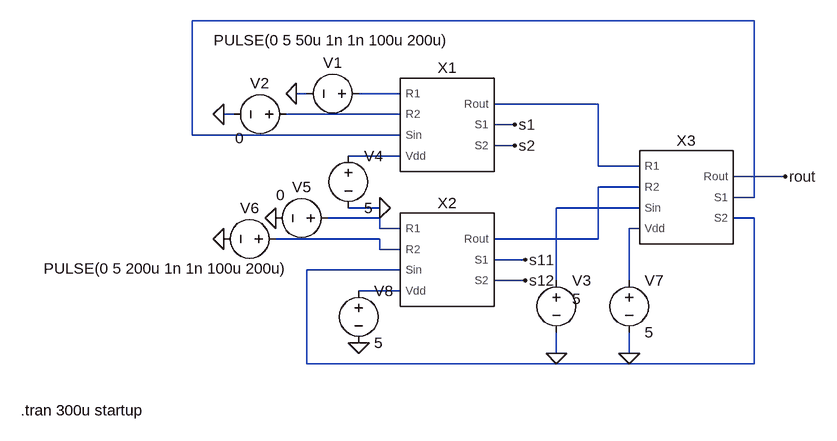
[diagram p0: schematic arbiter_tree.asc]
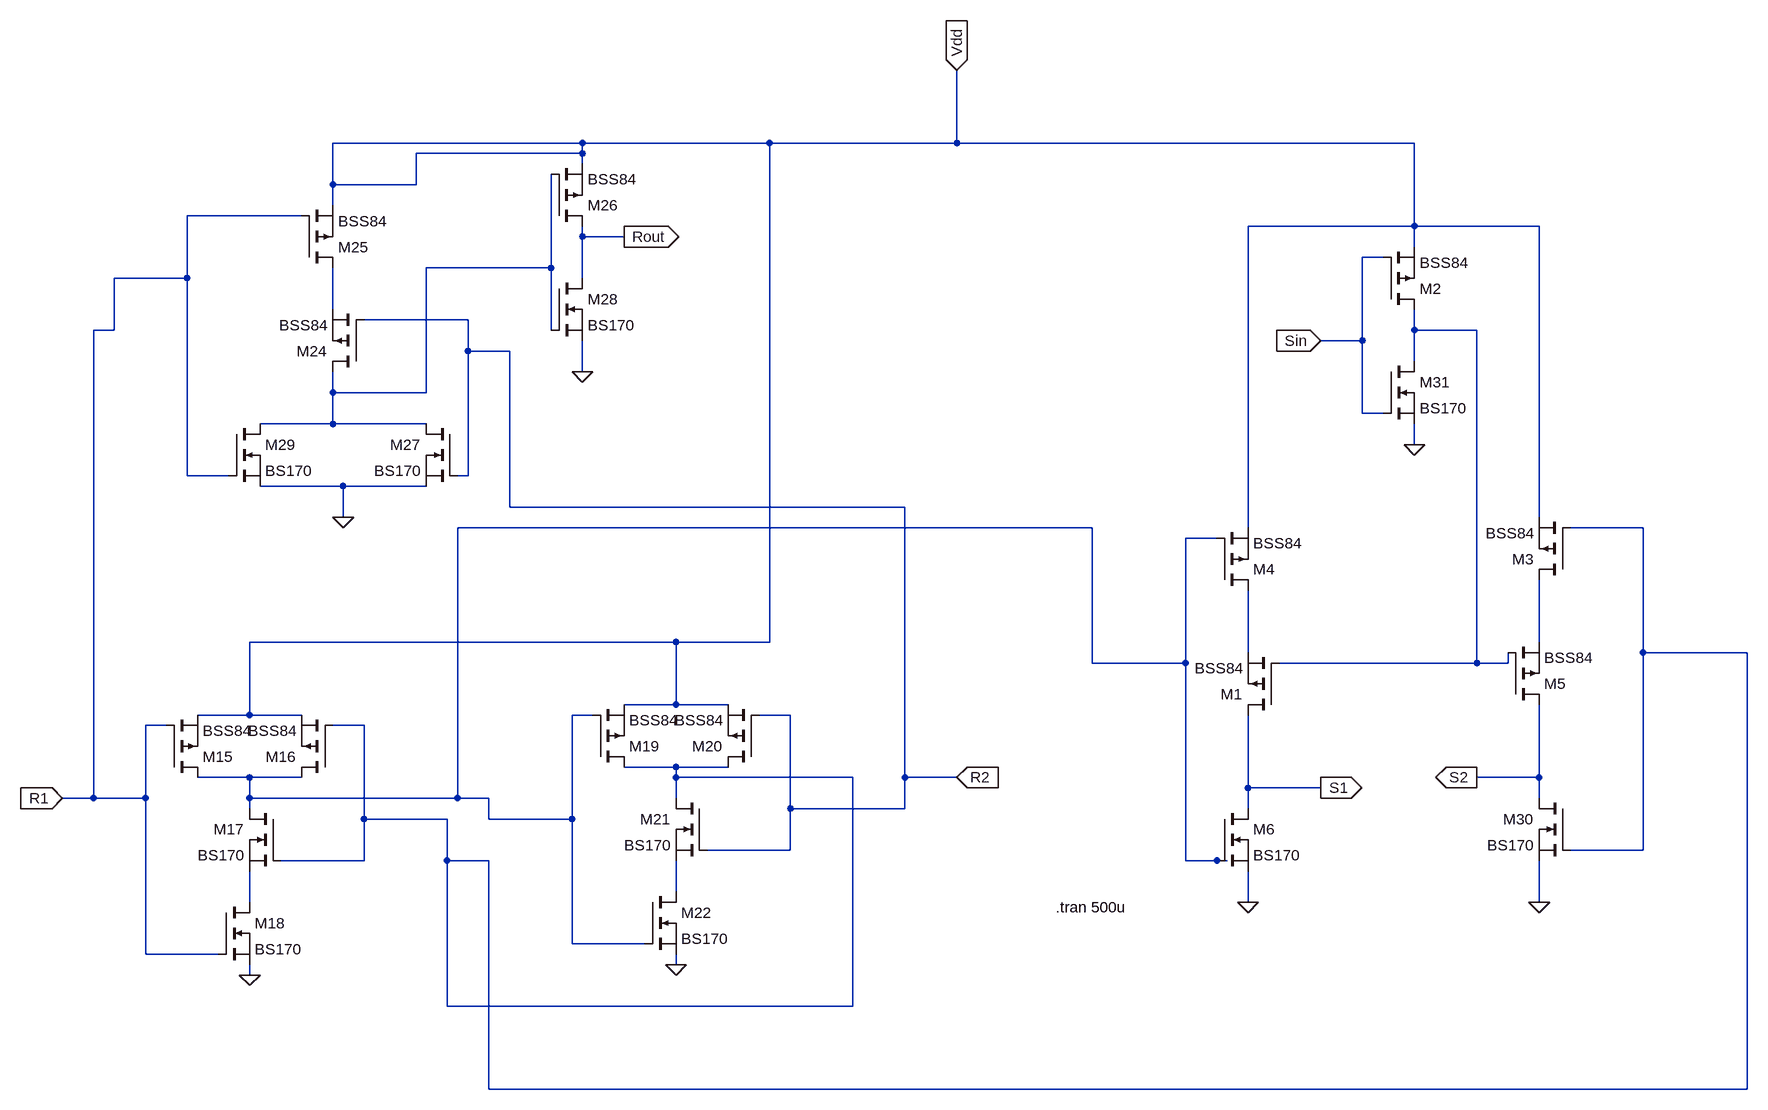
[diagram p1: sub-circuit arbiter.asc]
arbiter_tree.asc, the LTspice schematic file:
Version 4.1
SHEET 1 1124 680
WIRE 640 -80 -224 -80
WIRE -48 32 -64 32
WIRE 96 32 32 32
WIRE 400 48 240 48
WIRE -160 64 -176 64
WIRE 96 64 -80 64
WIRE 272 80 240 80
WIRE -224 96 -224 -80
WIRE 96 96 -224 96
WIRE 272 112 240 112
WIRE 96 128 16 128
WIRE 400 144 400 48
WIRE 464 144 400 144
WIRE 688 160 608 160
WIRE 464 176 400 176
WIRE 640 192 640 -80
WIRE 640 192 608 192
WIRE 64 208 16 208
WIRE 464 208 336 208
WIRE 64 224 -16 224
WIRE 640 224 608 224
WIRE 64 240 64 224
WIRE 96 240 64 240
WIRE 464 240 448 240
WIRE 64 256 -96 256
WIRE 400 256 400 176
WIRE 400 256 240 256
WIRE 64 272 64 256
WIRE 96 272 64 272
WIRE 288 288 240 288
WIRE 96 304 -48 304
WIRE 288 320 240 320
WIRE 336 320 336 208
WIRE 448 320 448 240
WIRE 96 336 32 336
WIRE 336 432 336 400
WIRE 448 432 448 400
WIRE -48 448 -48 304
WIRE 640 448 640 224
WIRE 640 448 -48 448
FLAG -64 32 0
FLAG -176 64 0
FLAG 64 208 0
FLAG -96 224 0
FLAG -176 256 0
FLAG 32 416 0
FLAG 336 432 0
FLAG 448 432 0
FLAG 272 80 s1
FLAG 272 112 s2
FLAG 288 288 s11
FLAG 288 320 s12
FLAG 688 160 rout
SYMBOL arbiter 160 80 R0
SYMATTR InstName X1
SYMBOL arbiter 160 288 R0
SYMATTR InstName X2
SYMBOL arbiter 528 192 R0
SYMATTR InstName X3
SYMBOL voltage 48 32 R90
WINDOW 0 -32 56 VBottom 2
WINDOW 3 -98 57 VTop 2
WINDOW 123 0 0 Left 0
WINDOW 39 0 0 Left 0
SYMATTR InstName V1
SYMATTR Value PULSE(0 5 50u 1n 1n 100u 200u)
SYMBOL voltage -64 64 R90
WINDOW 0 -32 56 VBottom 2
WINDOW 3 21 87 VTop 2
WINDOW 123 0 0 Left 0
WINDOW 39 0 0 Left 0
SYMATTR InstName V2
SYMATTR Value 0
SYMBOL voltage 16 112 R0
WINDOW 123 0 0 Left 0
WINDOW 39 0 0 Left 0
SYMATTR InstName V4
SYMATTR Value 5
SYMBOL voltage 0 224 R90
WINDOW 0 -32 56 VBottom 2
WINDOW 3 -51 88 VTop 2
WINDOW 123 0 0 Left 0
WINDOW 39 0 0 Left 0
SYMATTR InstName V5
SYMATTR Value 0
SYMBOL voltage -80 256 R90
WINDOW 0 -32 56 VBottom 2
WINDOW 3 30 184 VTop 2
WINDOW 123 0 0 Left 0
WINDOW 39 0 0 Left 0
SYMATTR InstName V6
SYMATTR Value PULSE(0 5 200u 1n 1n 100u 200u)
SYMBOL voltage 32 320 R0
WINDOW 123 0 0 Left 0
WINDOW 39 0 0 Left 0
SYMATTR InstName V8
SYMATTR Value 5
SYMBOL voltage 336 304 R0
WINDOW 3 24 44 Left 2
WINDOW 123 0 0 Left 0
WINDOW 39 0 0 Left 0
SYMATTR Value 5
SYMATTR InstName V3
SYMBOL voltage 448 304 R0
WINDOW 123 0 0 Left 0
WINDOW 39 0 0 Left 0
SYMATTR InstName V7
SYMATTR Value 5
TEXT -488 520 Left 2 !.tran 300u startup

arbiter.asc, the sub-circuit schematic file:
Version 4.1
SHEET 1 3980 2180
WIRE 464 0 80 0
WIRE 752 0 464 0
WIRE 1040 0 1040 -112
WIRE 1040 0 752 0
WIRE 1744 0 1040 0
WIRE 464 16 464 0
WIRE 464 16 208 16
WIRE 464 32 464 16
WIRE 80 64 80 0
WIRE 208 64 208 16
WIRE 208 64 80 64
WIRE 80 96 80 64
WIRE 32 112 -144 112
WIRE 1744 128 1744 0
WIRE 1744 128 1488 128
WIRE 1936 128 1744 128
WIRE 464 144 464 128
WIRE 528 144 464 144
WIRE 1744 160 1744 128
WIRE 1696 176 1664 176
WIRE 416 192 416 48
WIRE 416 192 224 192
WIRE -144 208 -144 112
WIRE -144 208 -256 208
WIRE 464 208 464 144
WIRE 80 256 80 192
WIRE 288 272 128 272
WIRE -256 288 -256 208
WIRE -256 288 -288 288
WIRE 416 288 416 192
WIRE 1744 288 1744 256
WIRE 1840 288 1744 288
WIRE 1664 304 1664 176
WIRE 1664 304 1600 304
WIRE 288 320 288 272
WIRE 352 320 288 320
WIRE 1744 336 1744 288
WIRE 464 352 464 304
WIRE 80 384 80 352
WIRE 224 384 224 192
WIRE 224 384 80 384
WIRE 1664 416 1664 304
WIRE 1696 416 1664 416
WIRE 80 432 80 384
WIRE 80 432 -32 432
WIRE 224 432 80 432
WIRE 1744 464 1744 432
WIRE -144 512 -144 208
WIRE -80 512 -144 512
WIRE 288 512 288 320
WIRE 288 512 272 512
WIRE 96 528 -32 528
WIRE 224 528 96 528
WIRE 352 560 352 320
WIRE 960 560 352 560
WIRE 96 576 96 528
WIRE 1936 576 1936 128
WIRE 1248 592 272 592
WIRE 1488 592 1488 128
WIRE 2096 592 1984 592
WIRE 1440 608 1392 608
WIRE 608 768 -48 768
WIRE 752 768 752 0
WIRE 752 768 608 768
WIRE 1936 768 1936 672
WIRE 1488 784 1488 688
WIRE 2096 784 2096 592
WIRE 2256 784 2096 784
WIRE 1248 800 1248 592
WIRE 1392 800 1392 608
WIRE 1392 800 1248 800
WIRE 1840 800 1840 288
WIRE 1840 800 1536 800
WIRE 1888 800 1888 784
WIRE 1888 800 1840 800
WIRE 608 864 608 768
WIRE 608 864 528 864
WIRE 688 864 608 864
WIRE -48 880 -48 768
WIRE -48 880 -128 880
WIRE 32 880 -48 880
WIRE 480 880 448 880
WIRE 784 880 736 880
WIRE -176 896 -208 896
WIRE 128 896 80 896
WIRE 608 960 528 960
WIRE 688 960 608 960
WIRE -48 976 -128 976
WIRE 32 976 -48 976
WIRE 608 976 608 960
WIRE 880 976 608 976
WIRE 960 976 960 560
WIRE 1040 976 960 976
WIRE 1936 976 1936 864
WIRE 1936 976 1840 976
WIRE 1488 992 1488 880
WIRE 1600 992 1488 992
WIRE -288 1008 -288 288
WIRE -288 1008 -336 1008
WIRE -208 1008 -208 896
WIRE -208 1008 -288 1008
WIRE -48 1008 -48 976
WIRE 272 1008 272 592
WIRE 272 1008 -48 1008
WIRE 320 1008 272 1008
WIRE 608 1008 608 976
WIRE 1936 1008 1936 976
WIRE -48 1024 -48 1008
WIRE 784 1024 784 880
WIRE 960 1024 960 976
WIRE 960 1024 784 1024
WIRE 1488 1024 1488 992
WIRE 128 1040 128 896
WIRE 256 1040 128 1040
WIRE 320 1040 320 1008
WIRE 448 1040 448 880
WIRE 448 1040 320 1040
WIRE 784 1088 784 1024
WIRE 784 1088 656 1088
WIRE 2096 1088 2096 784
WIRE 2096 1088 1984 1088
WIRE 128 1104 128 1040
WIRE 128 1104 0 1104
WIRE 256 1104 256 1040
WIRE 320 1104 256 1104
WIRE 1392 1104 1392 800
WIRE 1440 1104 1392 1104
WIRE 1456 1104 1440 1104
WIRE 608 1152 608 1104
WIRE -48 1168 -48 1120
WIRE 1488 1168 1488 1120
WIRE 1936 1168 1936 1104
WIRE 448 1232 448 1040
WIRE 560 1232 448 1232
WIRE -208 1248 -208 1008
WIRE -96 1248 -208 1248
WIRE 608 1264 608 1248
WIRE -48 1280 -48 1264
WIRE 256 1328 256 1104
WIRE 880 1328 880 976
WIRE 880 1328 256 1328
WIRE 320 1456 320 1104
WIRE 2256 1456 2256 784
WIRE 2256 1456 320 1456
FLAG 528 144 Rout
IOPIN 528 144 Out
FLAG -336 1008 R1
IOPIN -336 1008 In
FLAG 1040 976 R2
IOPIN 1040 976 In
FLAG 1600 992 S1
IOPIN 1600 992 Out
FLAG 1840 976 S2
IOPIN 1840 976 Out
FLAG 1600 304 Sin
IOPIN 1600 304 In
FLAG 1040 -112 Vdd
IOPIN 1040 -112 In
FLAG 96 576 0
FLAG 464 352 0
FLAG 1744 464 0
FLAG 1488 1168 0
FLAG 1936 1168 0
FLAG -48 1280 0
FLAG 608 1264 0
SYMBOL pmos 128 352 R180
SYMATTR InstName M24
SYMATTR Value BSS84
SYMBOL pmos 32 192 M180
SYMATTR InstName M25
SYMATTR Value BSS84
SYMBOL pmos 416 128 M180
SYMATTR InstName M26
SYMATTR Value BSS84
SYMBOL nmos 272 432 M0
SYMATTR InstName M27
SYMATTR Value BS170
SYMBOL nmos 416 208 R0
SYMATTR InstName M28
SYMATTR Value BS170
SYMBOL nmos -80 432 R0
SYMATTR InstName M29
SYMATTR Value BS170
SYMBOL pmos 1536 880 R180
SYMATTR InstName M1
SYMATTR Value BSS84
SYMBOL pmos 1696 256 M180
SYMATTR InstName M2
SYMATTR Value BSS84
SYMBOL pmos 1984 672 R180
SYMATTR InstName M3
SYMATTR Value BSS84
SYMBOL pmos 1440 688 M180
SYMATTR InstName M4
SYMATTR Value BSS84
SYMBOL pmos 1888 864 M180
SYMATTR InstName M5
SYMATTR Value BSS84
SYMBOL nmos 1440 1024 R0
SYMATTR InstName M6
SYMATTR Value BS170
SYMBOL nmos 1984 1008 M0
SYMATTR InstName M30
SYMATTR Value BS170
SYMBOL nmos 1696 336 R0
SYMATTR InstName M31
SYMATTR Value BS170
SYMBOL pmos -176 976 M180
SYMATTR InstName M15
SYMATTR Value BSS84
SYMBOL pmos 80 976 R180
SYMATTR InstName M16
SYMATTR Value BSS84
SYMBOL nmos 0 1024 M0
SYMATTR InstName M17
SYMATTR Value BS170
SYMBOL nmos -96 1168 R0
SYMATTR InstName M18
SYMATTR Value BS170
SYMBOL pmos 480 960 M180
SYMATTR InstName M19
SYMATTR Value BSS84
SYMBOL pmos 736 960 R180
SYMATTR InstName M20
SYMATTR Value BSS84
SYMBOL nmos 656 1008 M0
SYMATTR InstName M21
SYMATTR Value BS170
SYMBOL nmos 560 1152 R0
SYMATTR InstName M22
SYMATTR Value BS170
TEXT 1192 1176 Left 2 !.tran 500u

The netlist it stands for:
* arbiter_tree.asc
X§X1 N002 N004 N001 N005 N003 s1 s2 arbiter
X§X2 N008 N011 N009 N012 N006 s11 s12 arbiter
X§X3 N003 N006 N007 N010 rout N001 N009 arbiter
V1 N002 0 PULSE(0 5 50u 1n 1n 100u 200u)
V2 N004 0 0
V4 N005 0 5
V5 N008 0 0
V6 N011 0 PULSE(0 5 200u 1n 1n 100u 200u)
V8 N012 0 5
V3 N007 0 5
V7 N010 0 5

* block symbol definitions
.subckt arbiter R1 R2 Sin Vdd Rout S1 S2
M24 N001 R2 N002 N002 BSS84
M25 N002 R1 Vdd Vdd BSS84
M26 Rout N001 Vdd Vdd BSS84
M27 N001 R2 0 0 BS170
M28 Rout N001 0 0 BS170
M29 N001 R1 0 0 BS170
M1 S1 N003 N007 N007 BSS84
M2 N003 Sin Vdd Vdd BSS84
M3 N006 N005 Vdd Vdd BSS84
M4 N007 N004 Vdd Vdd BSS84
M5 S2 N003 N006 N006 BSS84
M6 S1 N004 0 0 BS170
M30 S2 N005 0 0 BS170
M31 N003 Sin 0 0 BS170
M15 N004 R1 Vdd Vdd BSS84
M16 N004 N005 Vdd Vdd BSS84
M17 N004 N005 N009 N009 BS170
M18 N009 R1 0 0 BS170
M19 N005 N004 Vdd Vdd BSS84
M20 N005 R2 Vdd Vdd BSS84
M21 N005 R2 N008 N008 BS170
M22 N008 N004 0 0 BS170
.tran 500u
.ends arbiter

.model NMOS NMOS
.model PMOS PMOS
.lib standard.mos
.tran 300u startup
.backanno
.end